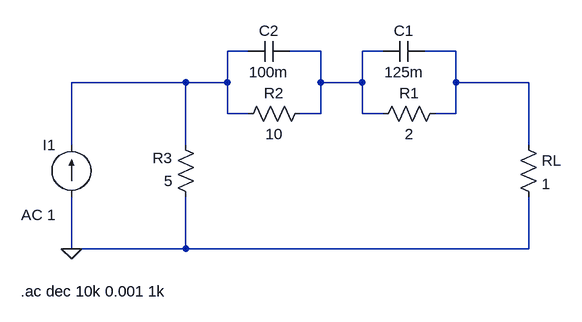
[diagram p0: schematic Punto5.asc]
Punto5.asc, the LTspice schematic file:
Version 4
SHEET 1 880 680
WIRE 192 80 160 80
WIRE 304 80 256 80
WIRE 400 80 368 80
WIRE 512 80 464 80
WIRE 96 128 -80 128
WIRE 160 128 160 80
WIRE 160 128 96 128
WIRE 304 128 304 80
WIRE 368 128 368 80
WIRE 368 128 304 128
WIRE 512 128 512 80
WIRE 624 128 512 128
WIRE 160 176 160 128
WIRE 192 176 160 176
WIRE 304 176 304 128
WIRE 304 176 272 176
WIRE 368 176 368 128
WIRE 400 176 368 176
WIRE 512 176 512 128
WIRE 512 176 480 176
WIRE -80 224 -80 128
WIRE 96 224 96 128
WIRE 624 224 624 128
WIRE -80 384 -80 304
WIRE 96 384 96 304
WIRE 96 384 -80 384
WIRE 624 384 624 304
WIRE 624 384 96 384
FLAG -80 384 0
SYMBOL current -80 304 R180
WINDOW 0 24 80 Left 2
WINDOW 3 24 0 Left 2
WINDOW 123 24 -28 Left 2
WINDOW 39 0 0 Left 0
SYMATTR InstName I1
SYMATTR Value ""
SYMATTR Value2 AC 1
SYMBOL res 496 160 R90
WINDOW 0 0 56 VBottom 2
WINDOW 3 32 56 VTop 2
SYMATTR InstName R1
SYMATTR Value 2
SYMBOL res 288 160 R90
WINDOW 0 0 56 VBottom 2
WINDOW 3 32 56 VTop 2
SYMATTR InstName R2
SYMATTR Value 10
SYMBOL res 112 320 R180
WINDOW 0 36 76 Left 2
WINDOW 3 36 40 Left 2
SYMATTR InstName R3
SYMATTR Value 5
SYMBOL cap 464 64 R90
WINDOW 0 0 32 VBottom 2
WINDOW 3 32 32 VTop 2
SYMATTR InstName C1
SYMATTR Value 125m
SYMBOL cap 256 64 R90
WINDOW 0 0 32 VBottom 2
WINDOW 3 32 32 VTop 2
SYMATTR InstName C2
SYMATTR Value 100m
SYMBOL res 608 208 R0
SYMATTR InstName RL
SYMATTR Value 1
TEXT -158 450 Left 2 !.ac dec 10k 0.001 1k

The netlist it stands for:
* Punto5.asc
I1 0 N001 AC 1
R1 N003 N002 2
R2 N002 N001 10
R3 0 N001 5
C1 N003 N002 125m
C2 N002 N001 100m
RL N003 0 1
.ac dec 10k 0.001 1k
.backanno
.end